# EAGLE schematic Relay_Cape (EAGLE 7.7.0)
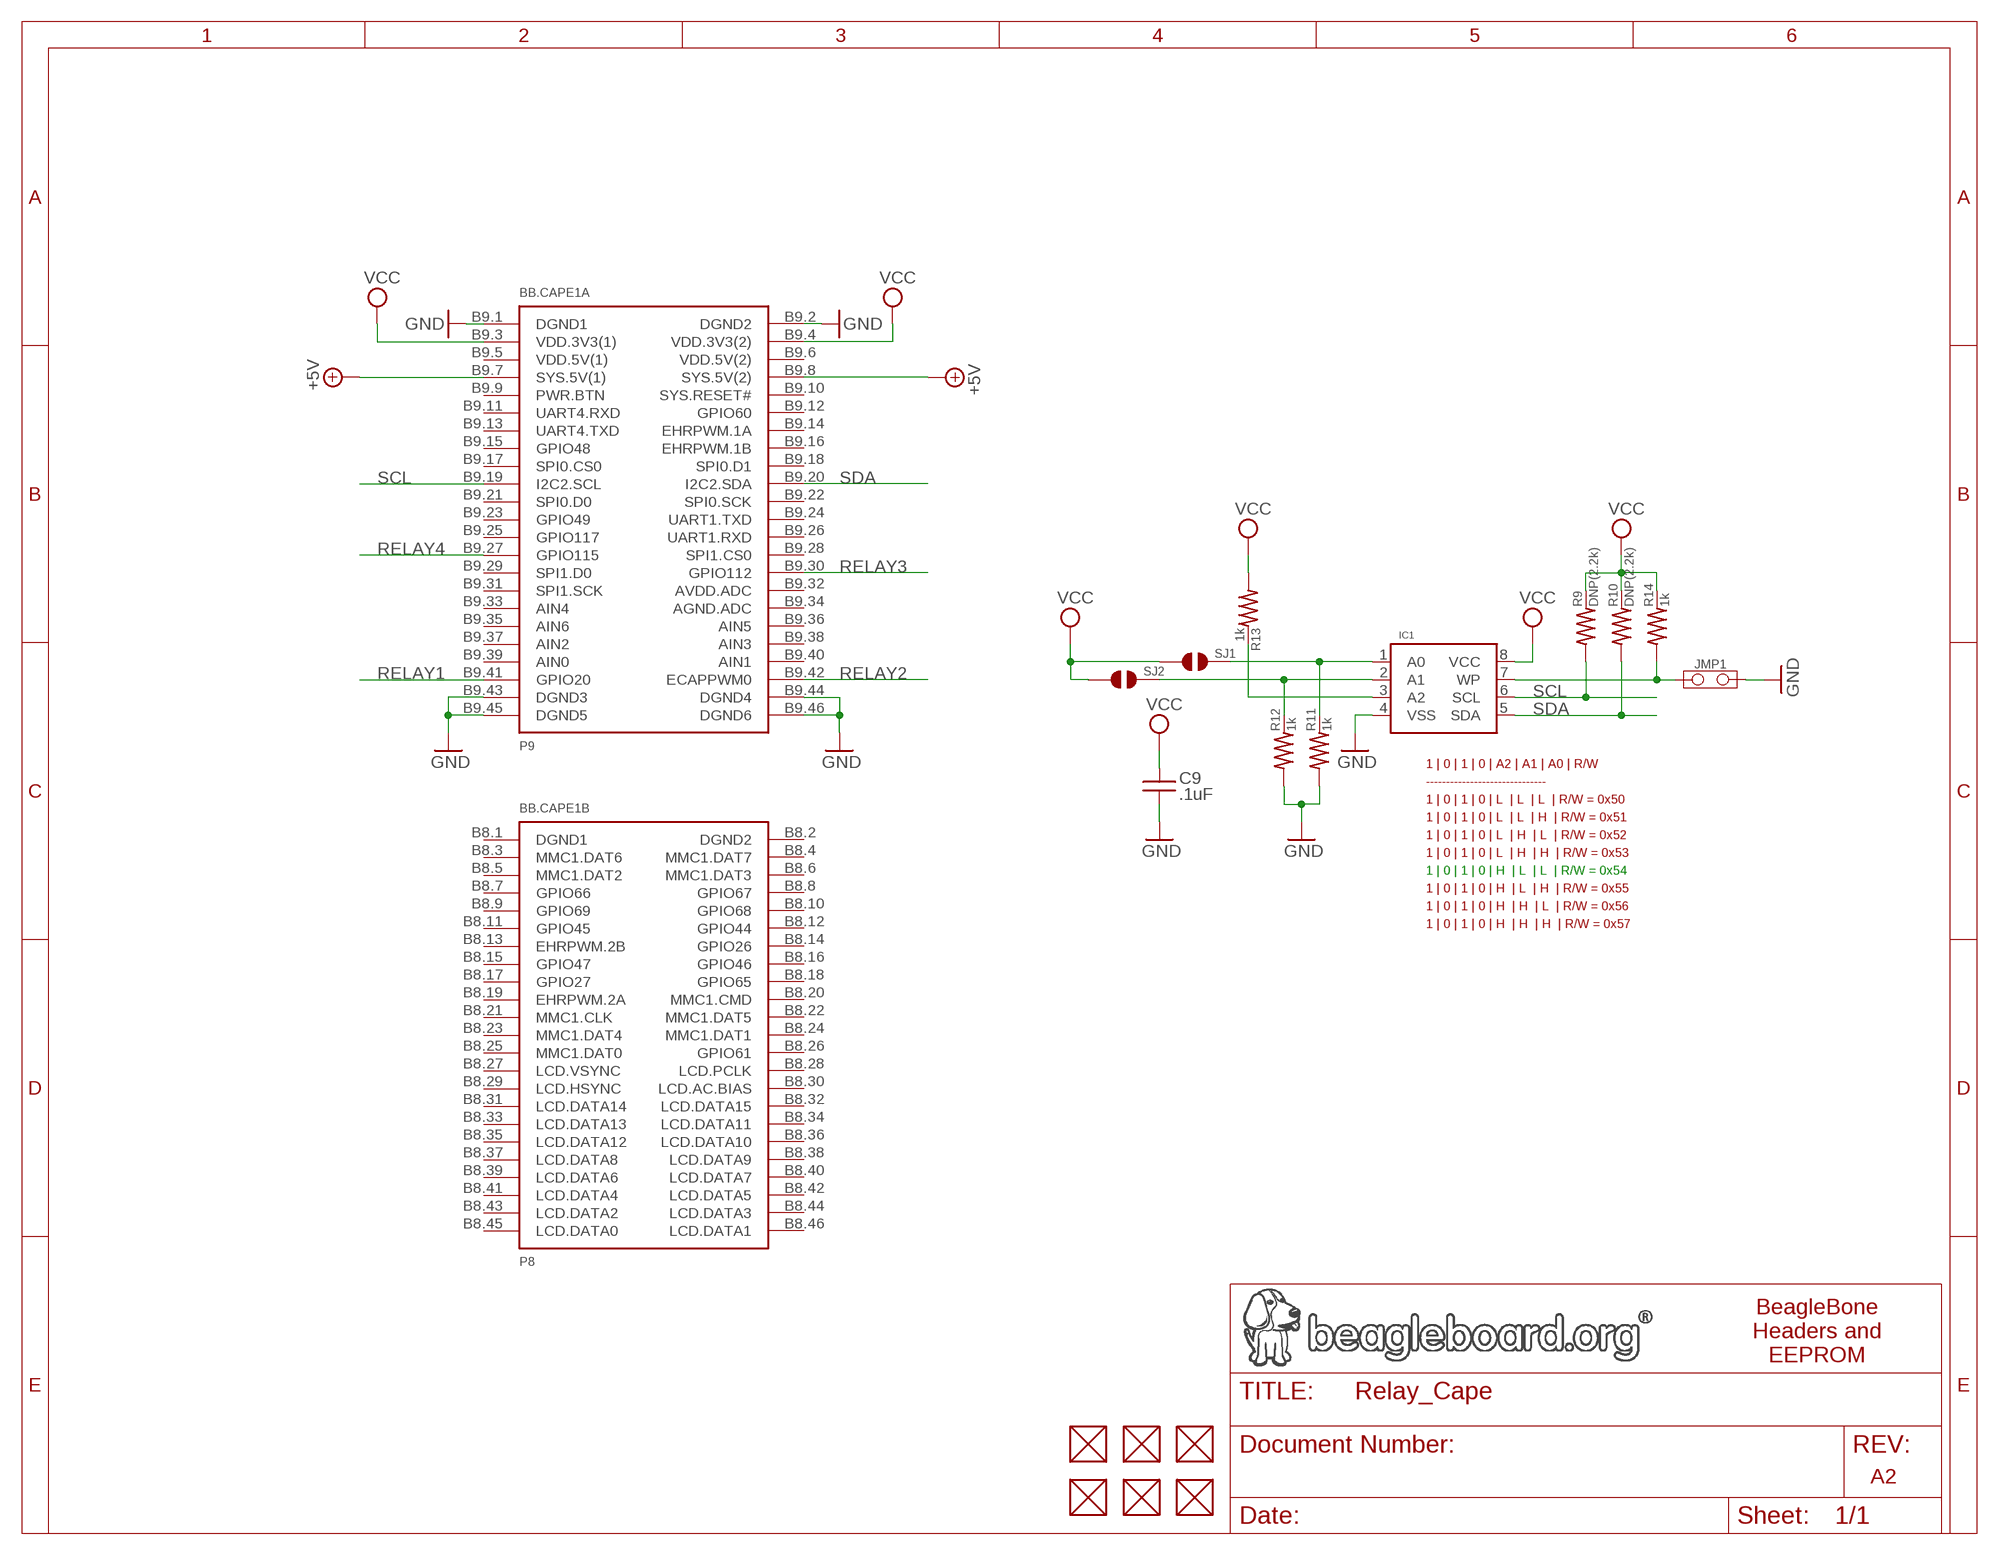
[diagram p0: schematic, sheet 1, part 1 of 2]
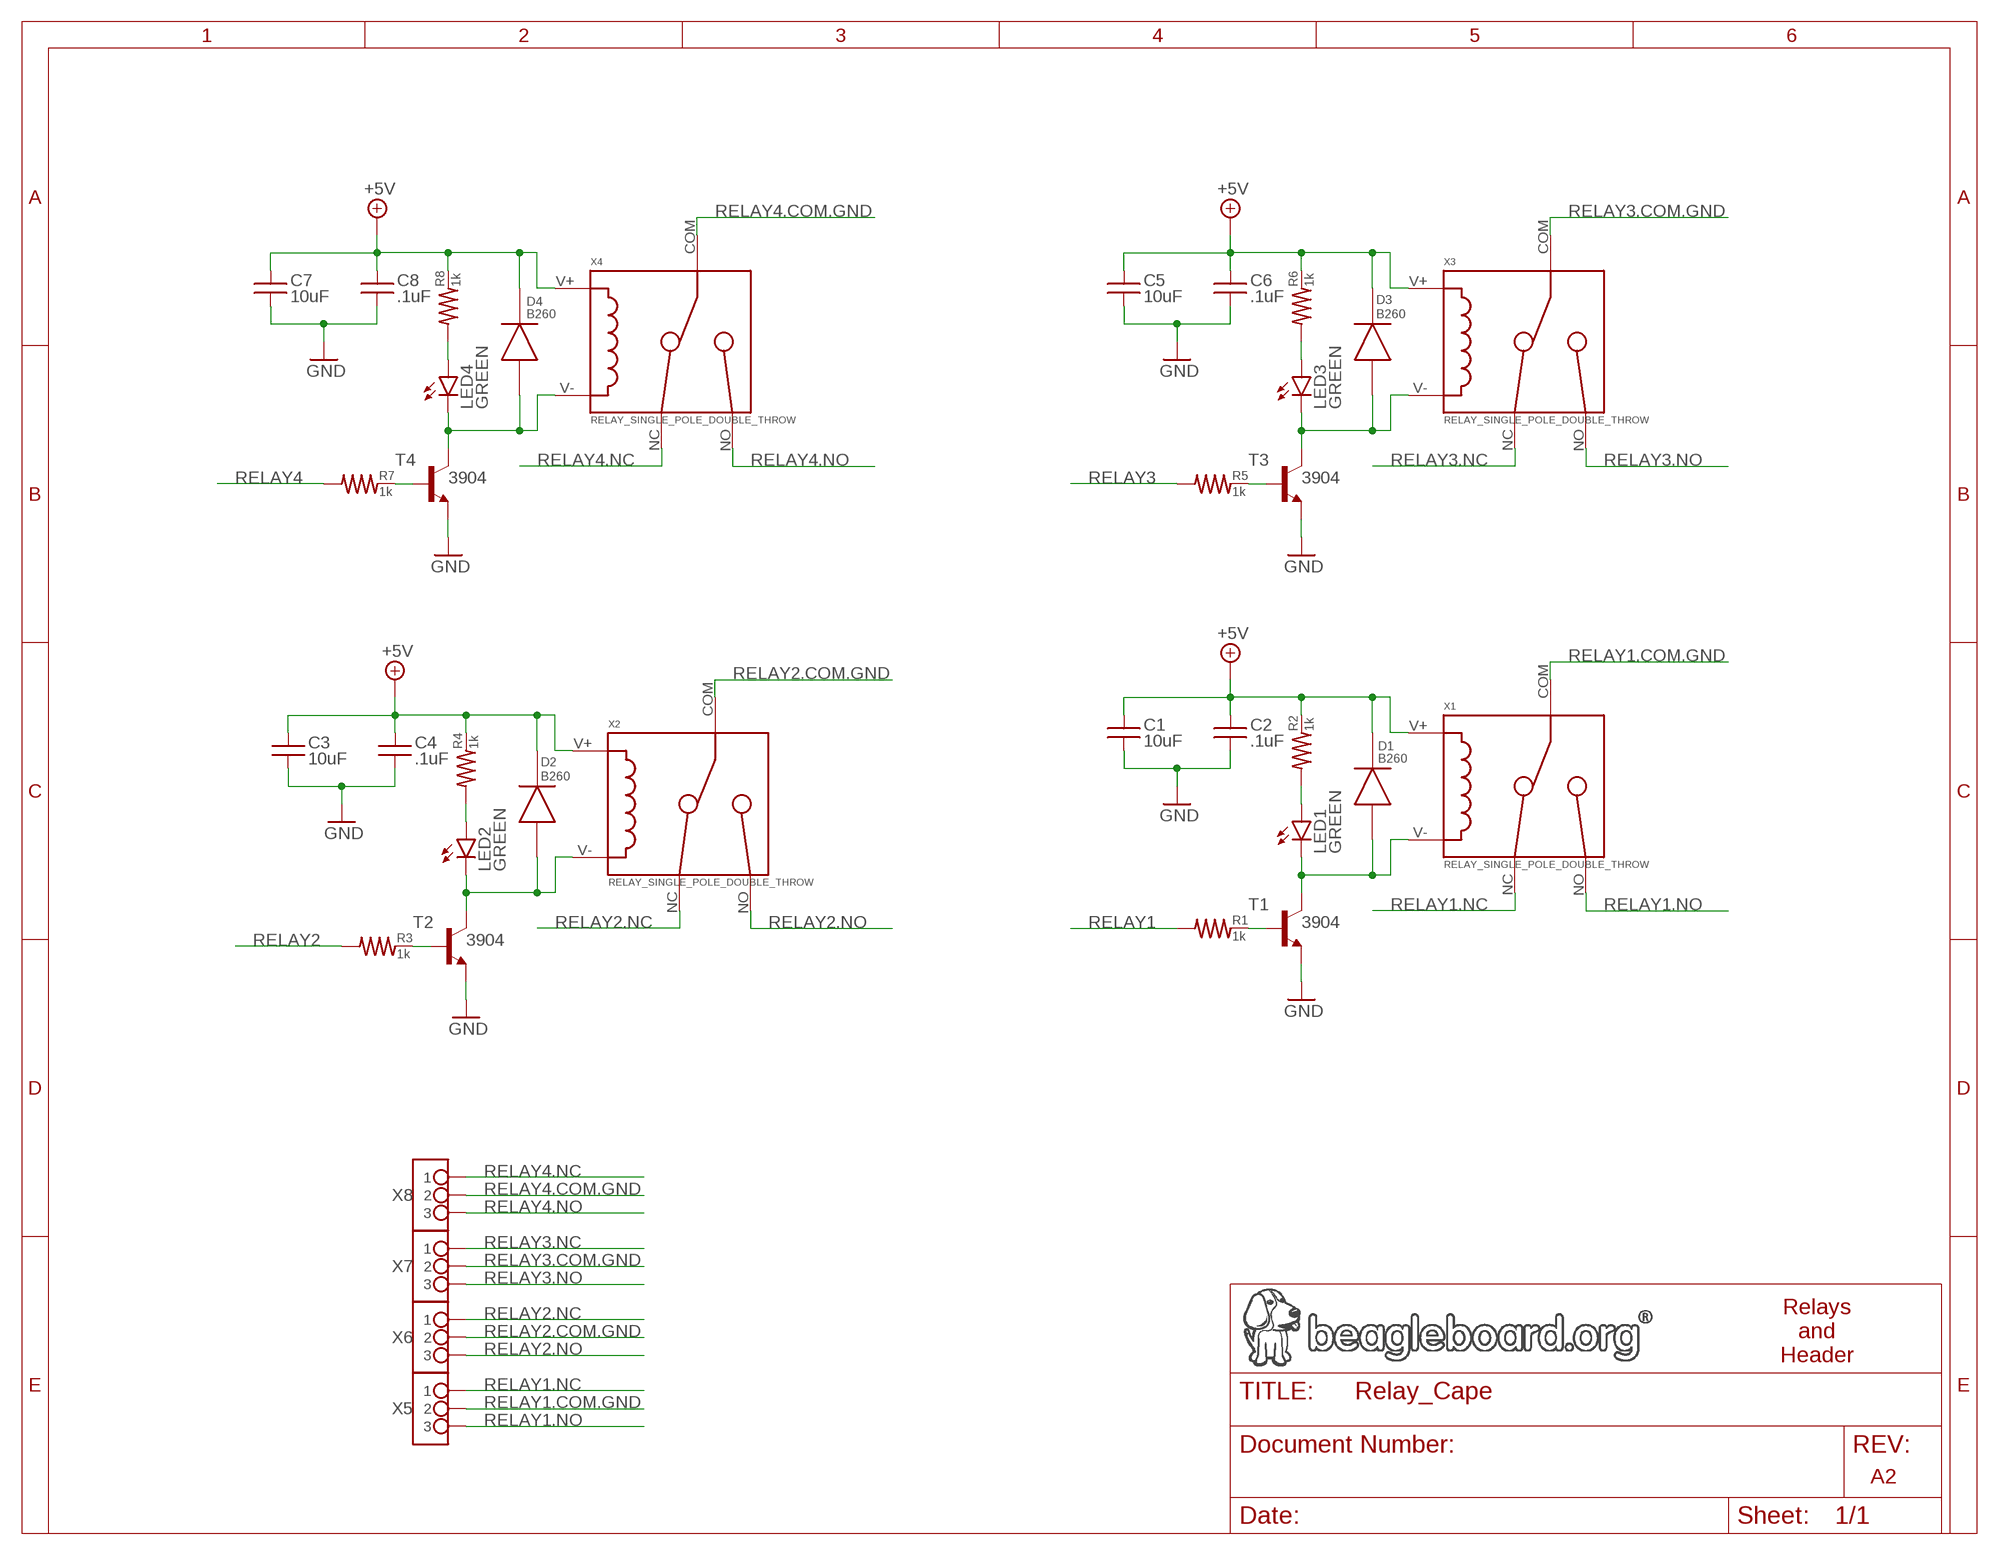
[diagram p1: schematic, sheet 1, part 2 of 2]

## Parts
BB.CAPE1  BEAGLEBONE.CAPE.BOTTOM-ONLY-PADS  [BEAGLEBONE.CAPE.BOTTOM-ONLY-PADS]
C1  10uF  CAPACITOR-(INCH)-0805  [0805]
C2  .1uF  CAPACITOR-(INCH)-0402  [0402]
C3  10uF  CAPACITOR-(INCH)-0805  [0805]
C4  .1uF  CAPACITOR-(INCH)-0402  [0402]
C5  10uF  CAPACITOR-(INCH)-0805  [0805]
C6  .1uF  CAPACITOR-(INCH)-0402  [0402]
C7  10uF  CAPACITOR-(INCH)-0805  [0805]
C8  .1uF  CAPACITOR-(INCH)-0402  [0402]
C9  .1uF  CAPACITOR-(INCH)-0402  [0402]
D1  B260  DIODE_SMA  [DIODE_SMA]
D2  B260  DIODE_SMA  [DIODE_SMA]
D3  B260  DIODE_SMA  [DIODE_SMA]
D4  B260  DIODE_SMA  [DIODE_SMA]
FUD1  FIDUCIAL  [FIDUCIAL_40MIL]
FUD2  FIDUCIAL  [FIDUCIAL_40MIL]
FUD3  FIDUCIAL  [FIDUCIAL_40MIL]
FUD4  FIDUCIAL  [FIDUCIAL_40MIL]
FUD5  FIDUCIAL  [FIDUCIAL_40MIL]
FUD6  FIDUCIAL  [FIDUCIAL_40MIL]
IC1  CAT24C32  [UDFN8,2X3(ON-SEMI)]
JMP1  JUMPER-(X2)  [JUMPER-(X2)]
LED1  GREEN  LED-(INCH)-0805  [0805-LED]
LED2  GREEN  LED-(INCH)-0805  [0805-LED]
LED3  GREEN  LED-(INCH)-0805  [0805-LED]
LED4  GREEN  LED-(INCH)-0805  [0805-LED]
R1  1k  RESISTOR-(INCH)-0402  [0402]
R2  1k  RESISTOR-(INCH)-0402  [0402]
R3  1k  RESISTOR-(INCH)-0402  [0402]
R4  1k  RESISTOR-(INCH)-0402  [0402]
R5  1k  RESISTOR-(INCH)-0402  [0402]
R6  1k  RESISTOR-(INCH)-0402  [0402]
R7  1k  RESISTOR-(INCH)-0402  [0402]
R8  1k  RESISTOR-(INCH)-0402  [0402]
R9  DNP(2.2k)  RESISTOR-(INCH)-0402  [0402]
R10  DNP(2.2k)  RESISTOR-(INCH)-0402  [0402]
R11  1k  RESISTOR-(INCH)-0402  [0402]
R12  1k  RESISTOR-(INCH)-0402  [0402]
R13  1k  RESISTOR-(INCH)-0402  [0402]
R14  1k  RESISTOR-(INCH)-0402  [0402]
SJ1  SOLDER.JOINT-(INCH)-0603  [SOLDER.JOINT(0603)]
SJ2  SOLDER.JOINT-(INCH)-0603  [SOLDER.JOINT(0603)]
T1  3904  BC847-NPN-SOT23-BEC  [SOT23-BEC]
T2  3904  BC847-NPN-SOT23-BEC  [SOT23-BEC]
T3  3904  BC847-NPN-SOT23-BEC  [SOT23-BEC]
T4  3904  BC847-NPN-SOT23-BEC  [SOT23-BEC]
X1  RELAY_SINGLE_POLE_DOUBLE_THROW  [GOODSKY.RWH-SH-105D]
X2  RELAY_SINGLE_POLE_DOUBLE_THROW  [GOODSKY.RWH-SH-105D]
X3  RELAY_SINGLE_POLE_DOUBLE_THROW  [GOODSKY.RWH-SH-105D]
X4  RELAY_SINGLE_POLE_DOUBLE_THROW  [GOODSKY.RWH-SH-105D]
X5  TB-3TERM-5MM.PITCH-(50MIL.HOLES)  [TERMINAL.BLOCK-3TERM-5MM.PITCH-(50MIL.HOLES)]
X6  TB-3TERM-5MM.PITCH-(50MIL.HOLES)  [TERMINAL.BLOCK-3TERM-5MM.PITCH-(50MIL.HOLES)]
X7  TB-3TERM-5MM.PITCH-(50MIL.HOLES)  [TERMINAL.BLOCK-3TERM-5MM.PITCH-(50MIL.HOLES)]
X8  TB-3TERM-5MM.PITCH-(50MIL.HOLES)  [TERMINAL.BLOCK-3TERM-5MM.PITCH-(50MIL.HOLES)]

## Nets
+5V: BB.CAPE1.B9.7(A:SYS.5V(1)) BB.CAPE1.B9.8(A:SYS.5V(2)) C1.1 C2.1 C3.1 C4.1 C5.1 C6.1 C7.1 C8.1 D1.K D2.K D3.K D4.K R2.2 R4.2 R6.2 R8.2 X1.V+ X2.V+ X3.V+ X4.V+
A0: IC1.1(A0) R11.2 SJ1.2
A1: IC1.2(A1) R12.2 SJ2.2
A2: IC1.3(A2) R13.2
GND: BB.CAPE1.B9.1(A:DGND1) BB.CAPE1.B9.2(A:DGND2) BB.CAPE1.B9.43(A:DGND3) BB.CAPE1.B9.44(A:DGND4) BB.CAPE1.B9.45(A:DGND5) BB.CAPE1.B9.46(A:DGND6) C1.2 C2.2 C3.2 C4.2 C5.2 C6.2 C7.2 C8.2 C9.2 IC1.4(VSS) JMP1.2 R11.1 R12.1 T1.E T2.E T3.E T4.E
LED1.A: LED4.A R8.1
LED2.A: LED3.A R6.1
LED3.A: LED2.A R4.1
LED4.A: LED1.A R2.1
RELAY1: BB.CAPE1.B9.41(A:GPIO20) R1.1
RELAY1.COM.GND: X1.COM X5.2
RELAY1.GND: D4.A LED4.K T4.C X4.V-
RELAY1.NC: X1.NC X5.1
RELAY1.NO: X1.NO X5.3
RELAY2: BB.CAPE1.B9.42(A:ECAPPWM0) R3.1
RELAY2.COM.GND: X2.COM X6.2
RELAY2.GND: D3.A LED3.K T3.C X3.V-
RELAY2.NC: X2.NC X6.1
RELAY2.NO: X2.NO X6.3
RELAY3: BB.CAPE1.B9.30(A:GPIO112) R5.1
RELAY3.COM.GND: X3.COM X7.2
RELAY3.GND: D2.A LED2.K T2.C X2.V-
RELAY3.NC: X3.NC X7.1
RELAY3.NO: X3.NO X7.3
RELAY4: BB.CAPE1.B9.27(A:GPIO115) R7.1
RELAY4.COM.GND: X4.COM X8.2
RELAY4.GND: D1.A LED1.K T1.C X1.V-
RELAY4.NC: X4.NC X8.1
RELAY4.NO: X4.NO X8.3
SCL: BB.CAPE1.B9.19(A:I2C2.SCL) IC1.6(SCL) R9.1
SDA: BB.CAPE1.B9.20(A:I2C2.SDA) IC1.5(SDA) R10.1
T1.BASE: R7.2 T4.B
T2.BASE: R5.2 T3.B
T3.BASE: R3.2 T2.B
T4.BASE: R1.2 T1.B
VCC: BB.CAPE1.B9.3(A:VDD.3V3(1)) BB.CAPE1.B9.4(A:VDD.3V3(2)) C9.1 IC1.8(VCC) R9.2 R10.2 R13.1 R14.2 SJ1.1 SJ2.1
WP: IC1.7(WP) JMP1.1 R14.1
Unconnected: BB.CAPE1.B8.1(B:DGND1) BB.CAPE1.B8.2(B:DGND2) BB.CAPE1.B8.3(B:MMC1.DAT6) BB.CAPE1.B8.4(B:MMC1.DAT7) BB.CAPE1.B8.5(B:MMC1.DAT2) BB.CAPE1.B8.6(B:MMC1.DAT3) BB.CAPE1.B8.7(B:GPIO66) BB.CAPE1.B8.8(B:GPIO67) BB.CAPE1.B8.9(B:GPIO69) BB.CAPE1.B8.10(B:GPIO68) BB.CAPE1.B8.11(B:GPIO45) BB.CAPE1.B8.12(B:GPIO44) BB.CAPE1.B8.13(B:EHRPWM.2B) BB.CAPE1.B8.14(B:GPIO26) BB.CAPE1.B8.15(B:GPIO47) BB.CAPE1.B8.16(B:GPIO46) BB.CAPE1.B8.17(B:GPIO27) BB.CAPE1.B8.18(B:GPIO65) BB.CAPE1.B8.19(B:EHRPWM.2A) BB.CAPE1.B8.20(B:MMC1.CMD) BB.CAPE1.B8.21(B:MMC1.CLK) BB.CAPE1.B8.22(B:MMC1.DAT5) BB.CAPE1.B8.23(B:MMC1.DAT4) BB.CAPE1.B8.24(B:MMC1.DAT1) BB.CAPE1.B8.25(B:MMC1.DAT0) BB.CAPE1.B8.26(B:GPIO61) BB.CAPE1.B8.27(B:LCD.VSYNC) BB.CAPE1.B8.28(B:LCD.PCLK) BB.CAPE1.B8.29(B:LCD.HSYNC) BB.CAPE1.B8.30(B:LCD.AC.BIAS) BB.CAPE1.B8.31(B:LCD.DATA14) BB.CAPE1.B8.32(B:LCD.DATA15) BB.CAPE1.B8.33(B:LCD.DATA13) BB.CAPE1.B8.34(B:LCD.DATA11) BB.CAPE1.B8.35(B:LCD.DATA12) BB.CAPE1.B8.36(B:LCD.DATA10) BB.CAPE1.B8.37(B:LCD.DATA8) BB.CAPE1.B8.38(B:LCD.DATA9) BB.CAPE1.B8.39(B:LCD.DATA6) BB.CAPE1.B8.40(B:LCD.DATA7) BB.CAPE1.B8.41(B:LCD.DATA4) BB.CAPE1.B8.42(B:LCD.DATA5) BB.CAPE1.B8.43(B:LCD.DATA2) BB.CAPE1.B8.44(B:LCD.DATA3) BB.CAPE1.B8.45(B:LCD.DATA0) BB.CAPE1.B8.46(B:LCD.DATA1) BB.CAPE1.B9.5(A:VDD.5V(1)) BB.CAPE1.B9.6(A:VDD.5V(2)) BB.CAPE1.B9.9(A:PWR.BTN) BB.CAPE1.B9.10(A:SYS.RESET#) BB.CAPE1.B9.11(A:UART4.RXD) BB.CAPE1.B9.12(A:GPIO60) BB.CAPE1.B9.13(A:UART4.TXD) BB.CAPE1.B9.14(A:EHRPWM.1A) BB.CAPE1.B9.15(A:GPIO48) BB.CAPE1.B9.16(A:EHRPWM.1B) BB.CAPE1.B9.17(A:SPI0.CS0) BB.CAPE1.B9.18(A:SPI0.D1) BB.CAPE1.B9.21(A:SPI0.D0) BB.CAPE1.B9.22(A:SPI0.SCK) BB.CAPE1.B9.23(A:GPIO49) BB.CAPE1.B9.24(A:UART1.TXD) BB.CAPE1.B9.25(A:GPIO117) BB.CAPE1.B9.26(A:UART1.RXD) BB.CAPE1.B9.28(A:SPI1.CS0) BB.CAPE1.B9.29(A:SPI1.D0) BB.CAPE1.B9.31(A:SPI1.SCK) BB.CAPE1.B9.32(A:AVDD.ADC) BB.CAPE1.B9.33(A:AIN4) BB.CAPE1.B9.34(A:AGND.ADC) BB.CAPE1.B9.35(A:AIN6) BB.CAPE1.B9.36(A:AIN5) BB.CAPE1.B9.37(A:AIN2) BB.CAPE1.B9.38(A:AIN3) BB.CAPE1.B9.39(A:AIN0) BB.CAPE1.B9.40(A:AIN1) FUD1.P$1 FUD2.P$1 FUD3.P$1 FUD4.P$1 FUD5.P$1 FUD6.P$1

## Notes on the sheet
- 1 | 0 | 1 | 0 | A2 | A1 | A0 | R/W
- ------------------------------
- 1 | 0 | 1 | 0 | L  | L  | L  | R/W = 0x50
- 1 | 0 | 1 | 0 | L  | L  | H  | R/W = 0x51
- 1 | 0 | 1 | 0 | L  | H  | L  | R/W = 0x52
- 1 | 0 | 1 | 0 | L  | H  | H  | R/W = 0x53
- 1 | 0 | 1 | 0 | H  | L  | L  | R/W = 0x54
- 1 | 0 | 1 | 0 | H  | L  | H  | R/W = 0x55
- 1 | 0 | 1 | 0 | H  | H  | L  | R/W = 0x56
- 1 | 0 | 1 | 0 | H  | H  | H  | R/W = 0x57
- BeagleBone
  Headers and
  EEPROM
- Relays
  and
  Header
- A2 | A2

## Library data of the parts
BB.CAPE1 = GHI-Solutions:BEAGLEBONE.CAPE.
C1-C9 = GHI-BasicComponents:CAPACITOR-(INCH)-: Basic SMD ceramic capacitors
D1-D4 = GHI:DIODE_SMA
FUD1-FUD6 = GHI:FIDUCIAL
IC1 = GHI-IC:CAT24C32: 32-Kb I2C CMOS Serial EEPROM
JMP1 = GHI-Headers:JUMPER-(X2)
LED1-LED4 = GHI-BasicComponents:LED-(INCH)-: Basic SMD LEDs
R1-R14 = GHI-BasicComponents:RESISTOR-(INCH)-: Basic SMD Resistors
SJ1 SJ2 = GHI-Miscellaneous:SOLDER.JOINT-(INCH)-: Solder Joint (Bridge) Pads - For easy solder joining.
T1-T4 = transistor:*-NPN-: NPN Transistror BF959 corrected 2008.03.06
X1-X4 = GHI2:RELAY_SINGLE_POLE_DOUBLE_THROW: Single Pole Double Throw Form C Relay. NO/NC
X5-X8 = GHI-Connectors:TB-3TERM-5MM.PITCH